# Altium schematic sheet MOTO1.SchDoc
size A4
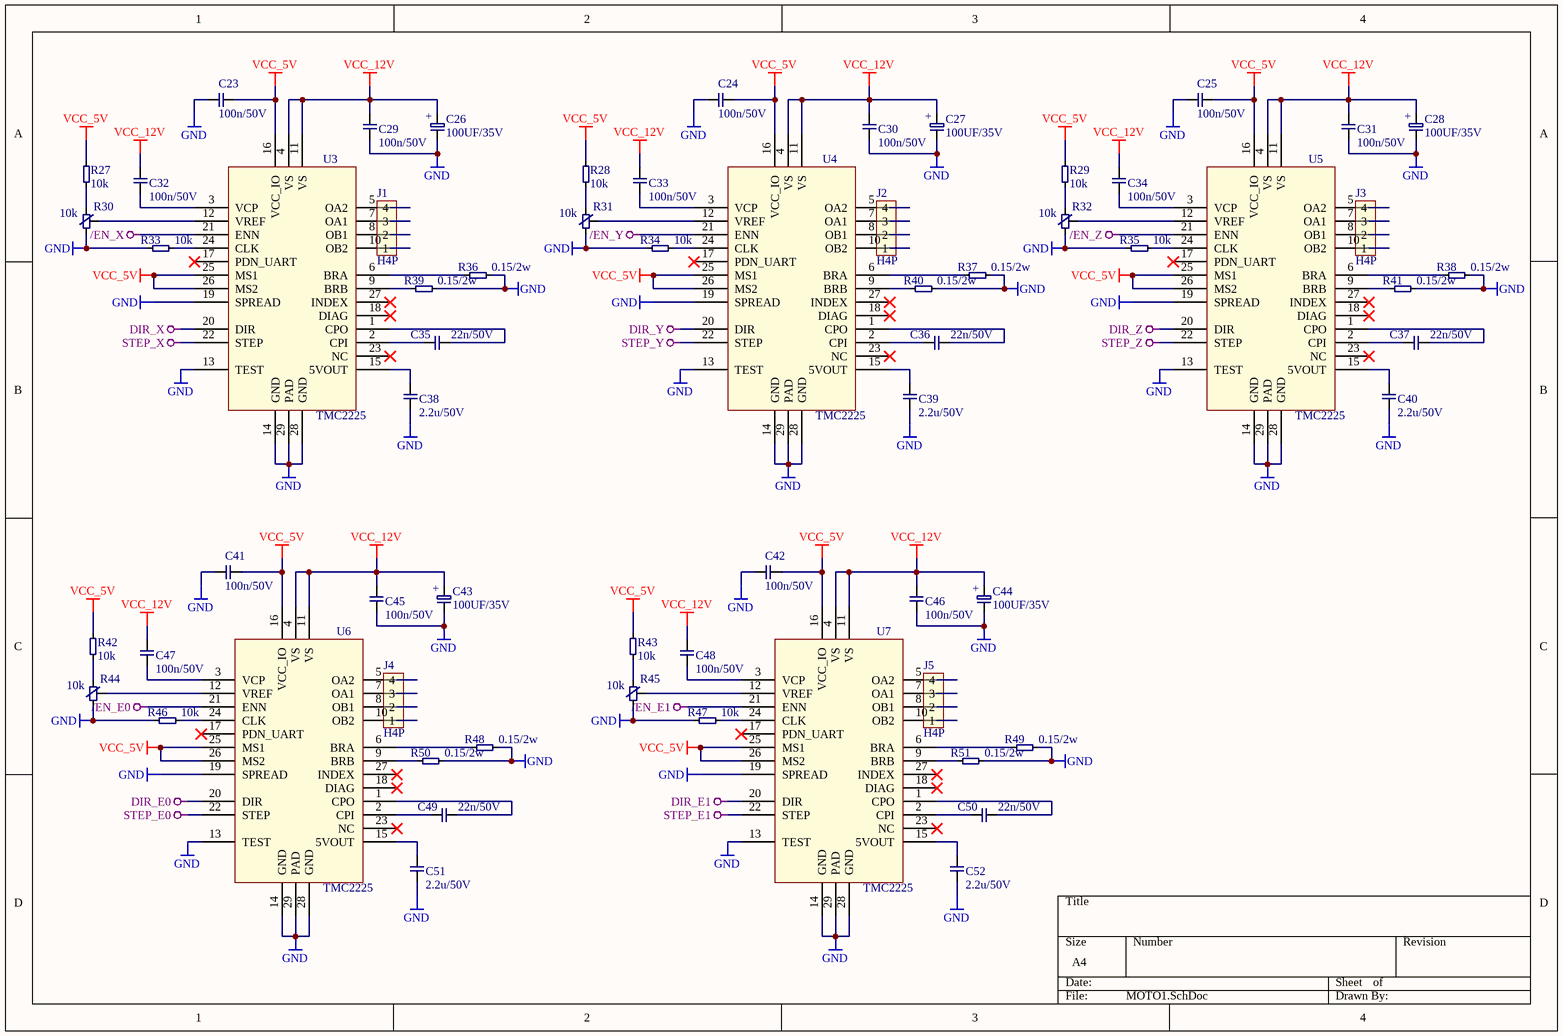
[diagram p0: MOTO1.SchDoc]

## Parts
C23  100n/50V  [C0603(1608)]
C24  100n/50V  [C0603(1608)]
C25  100n/50V  [C0603(1608)]
C26  100UF/35V  [C6.3x7.7贴片铝电解电容]
C27  100UF/35V  [C6.3x7.7贴片铝电解电容]
C28  100UF/35V  [C6.3x7.7贴片铝电解电容]
C29  100n/50V  [C0603(1608)]
C30  100n/50V  [C0603(1608)]
C31  100n/50V  [C0603(1608)]
C32  100n/50V  [C0603(1608)]
C33  100n/50V  [C0603(1608)]
C34  100n/50V  [C0603(1608)]
C35  22n/50V  [C0603(1608)]
C36  22n/50V  [C0603(1608)]
C37  22n/50V  [C0603(1608)]
C38  2.2u/50V  [C0805(2012)]
C39  2.2u/50V  [C0805(2012)]
C40  2.2u/50V  [C0805(2012)]
C41  100n/50V  [C0603(1608)]
C42  100n/50V  [C0603(1608)]
C43  100UF/35V  [C6.3x7.7贴片铝电解电容]
C44  100UF/35V  [C6.3x7.7贴片铝电解电容]
C45  100n/50V  [C0603(1608)]
C46  100n/50V  [C0603(1608)]
C47  100n/50V  [C0603(1608)]
C48  100n/50V  [C0603(1608)]
C49  22n/50V  [C0603(1608)]
C50  22n/50V  [C0603(1608)]
C51  2.2u/50V  [C0805(2012)]
C52  2.2u/50V  [C0805(2012)]
J1  H4P  [XH2.54(2.5mm)x4P]
J2  H4P  [XH2.54(2.5mm)x4P]
J3  H4P  [XH2.54(2.5mm)x4P]
J4  H4P  [XH2.54(2.5mm)x4P]
J5  H4P  [XH2.54(2.5mm)x4P]
R27  10k  [R0603(1608)]
R28  10k  [R0603(1608)]
R29  10k  [R0603(1608)]
R30  10k  [R3x3-贴片电位器]
R31  10k  [R3x3-贴片电位器]
R32  10k  [R3x3-贴片电位器]
R33  10k  [R0603(1608)]
R34  10k  [R0603(1608)]
R35  10k  [R0603(1608)]
R36  0.15/2w  [R2512]
R37  0.15/2w  [R2512]
R38  0.15/2w  [R2512]
R39  0.15/2w  [R2512]
R40  0.15/2w  [R2512]
R41  0.15/2w  [R2512]
R42  10k  [R0603(1608)]
R43  10k  [R0603(1608)]
R44  10k  [R3x3-贴片电位器]
R45  10k  [R3x3-贴片电位器]
R46  10k  [R0603(1608)]
R47  10k  [R0603(1608)]
R48  0.15/2w  [R2512]
R49  0.15/2w  [R2512]
R50  0.15/2w  [R2512]
R51  0.15/2w  [R2512]
U3  TMC2225  [HTSSOP28]
U4  TMC2225  [HTSSOP28]
U5  TMC2225  [HTSSOP28]
U6  TMC2225  [HTSSOP28]
U7  TMC2225  [HTSSOP28]

## Nets
/EN_E0: U6.21(ENN)
/EN_E1: U7.21(ENN)
/EN_X: U3.21(ENN)
/EN_Y: U4.21(ENN)
/EN_Z: U5.21(ENN)
DIR_E0: U6.20(DIR)
DIR_E1: U7.20(DIR)
DIR_X: U3.20(DIR)
DIR_Y: U4.20(DIR)
DIR_Z: U5.20(DIR)
GND: C23.2 C24.2 C25.2 C26.2 C27.2 C28.2 C29.2 C30.2 C31.2 C38.2 C39.2 C40.2 C41.2 C42.2 C43.2 C44.2 C45.2 C46.2 C51.2 C52.2 R30.3 R31.3 R32.3 R33.2 R34.2 R35.2 R36.1 R37.1 R38.1 R39.1 R40.1 R41.1 R44.3 R45.3 R46.2 R47.2 R48.1 R49.1 R50.1 R51.1 U3.13(TEST) U3.14(GND) U3.19(SPREAD) U3.28(GND) U3.29(PAD) U4.13(TEST) U4.14(GND) U4.19(SPREAD) U4.28(GND) U4.29(PAD) U5.13(TEST) U5.14(GND) U5.19(SPREAD) U5.28(GND) U5.29(PAD) U6.13(TEST) U6.14(GND) U6.19(SPREAD) U6.28(GND) U6.29(PAD) U7.13(TEST) U7.14(GND) U7.19(SPREAD) U7.28(GND) U7.29(PAD)
STEP_E0: U6.22(STEP)
STEP_E1: U7.22(STEP)
STEP_X: U3.22(STEP)
STEP_Y: U4.22(STEP)
STEP_Z: U5.22(STEP)
VCC_5V: C23.1 C24.1 C25.1 C41.1 C42.1 R27.2 R28.2 R29.2 R42.2 R43.2 U3.16(VCC_IO) U3.25(MS1) U3.26(MS2) U4.16(VCC_IO) U4.25(MS1) U4.26(MS2) U5.16(VCC_IO) U5.25(MS1) U5.26(MS2) U6.16(VCC_IO) U6.25(MS1) U6.26(MS2) U7.16(VCC_IO) U7.25(MS1) U7.26(MS2)
VCC_12V: C26.1 C27.1 C28.1 C29.1 C30.1 C31.1 C32.1 C33.1 C34.1 C43.1 C44.1 C45.1 C46.1 C47.1 C48.1 U3.4(VS) U3.11(VS) U4.4(VS) U4.11(VS) U5.4(VS) U5.11(VS) U6.4(VS) U6.11(VS) U7.4(VS) U7.11(VS)
NetC32_2: C32.2 U3.3(VCP)
NetC33_2: C33.2 U4.3(VCP)
NetC34_2: C34.2 U5.3(VCP)
NetC35_1: C35.1 U3.2(CPI)
NetC35_2: C35.2 U3.1(CPO)
NetC36_1: C36.1 U4.2(CPI)
NetC36_2: C36.2 U4.1(CPO)
NetC37_1: C37.1 U5.2(CPI)
NetC37_2: C37.2 U5.1(CPO)
NetC38_1: C38.1 U3.15(5VOUT)
NetC39_1: C39.1 U4.15(5VOUT)
NetC40_1: C40.1 U5.15(5VOUT)
NetC47_2: C47.2 U6.3(VCP)
NetC48_2: C48.2 U7.3(VCP)
NetC49_1: C49.1 U6.2(CPI)
NetC49_2: C49.2 U6.1(CPO)
NetC50_1: C50.1 U7.2(CPI)
NetC50_2: C50.2 U7.1(CPO)
NetC51_1: C51.1 U6.15(5VOUT)
NetC52_1: C52.1 U7.15(5VOUT)
NetJ1_1: J1.1 U3.10(OB2)
NetJ1_2: J1.2 U3.8(OB1)
NetJ1_3: J1.3 U3.7(OA1)
NetJ1_4: J1.4 U3.5(OA2)
NetJ2_1: J2.1 U4.10(OB2)
NetJ2_2: J2.2 U4.8(OB1)
NetJ2_3: J2.3 U4.7(OA1)
NetJ2_4: J2.4 U4.5(OA2)
NetJ3_1: J3.1 U5.10(OB2)
NetJ3_2: J3.2 U5.8(OB1)
NetJ3_3: J3.3 U5.7(OA1)
NetJ3_4: J3.4 U5.5(OA2)
NetJ4_1: J4.1 U6.10(OB2)
NetJ4_2: J4.2 U6.8(OB1)
NetJ4_3: J4.3 U6.7(OA1)
NetJ4_4: J4.4 U6.5(OA2)
NetJ5_1: J5.1 U7.10(OB2)
NetJ5_2: J5.2 U7.8(OB1)
NetJ5_3: J5.3 U7.7(OA1)
NetJ5_4: J5.4 U7.5(OA2)
NetR27_1: R27.1 R30.1
NetR28_1: R28.1 R31.1
NetR29_1: R29.1 R32.1
NetR30_2: R30.2 U3.12(VREF)
NetR31_2: R31.2 U4.12(VREF)
NetR32_2: R32.2 U5.12(VREF)
NetR33_1: R33.1 U3.24(CLK)
NetR34_1: R34.1 U4.24(CLK)
NetR35_1: R35.1 U5.24(CLK)
NetR36_2: R36.2 U3.6(BRA)
NetR37_2: R37.2 U4.6(BRA)
NetR38_2: R38.2 U5.6(BRA)
NetR39_2: R39.2 U3.9(BRB)
NetR40_2: R40.2 U4.9(BRB)
NetR41_2: R41.2 U5.9(BRB)
NetR42_1: R42.1 R44.1
NetR43_1: R43.1 R45.1
NetR44_2: R44.2 U6.12(VREF)
NetR45_2: R45.2 U7.12(VREF)
NetR46_1: R46.1 U6.24(CLK)
NetR47_1: R47.1 U7.24(CLK)
NetR48_2: R48.2 U6.6(BRA)
NetR49_2: R49.2 U7.6(BRA)
NetR50_2: R50.2 U6.9(BRB)
NetR51_2: R51.2 U7.9(BRB)

Not connected (* = marked no-connect by the designer): U3 17(PDN_UART)* 18(DIAG)* 23(NC)* 27(INDEX)*; U4 17(PDN_UART)* 18(DIAG)* 23(NC)* 27(INDEX)*; U5 17(PDN_UART)* 18(DIAG)* 23(NC)* 27(INDEX)*; U6 17(PDN_UART)* 18(DIAG)* 23(NC)* 27(INDEX)*; U7 17(PDN_UART)* 18(DIAG)* 23(NC)* 27(INDEX)*

## Notes on the sheet
- (in symbol Capsp) +

## Library data of the parts
C23-C25 C29-C42 C45-C52 = Caps
C26-C28 C43 C44 = Capsp
R27-R29 R33-R43 R46-R51 = Ress
R30-R32 R44 R45 = Resc